# Altium schematic sheet LCD_Direct.SchDoc
size A4
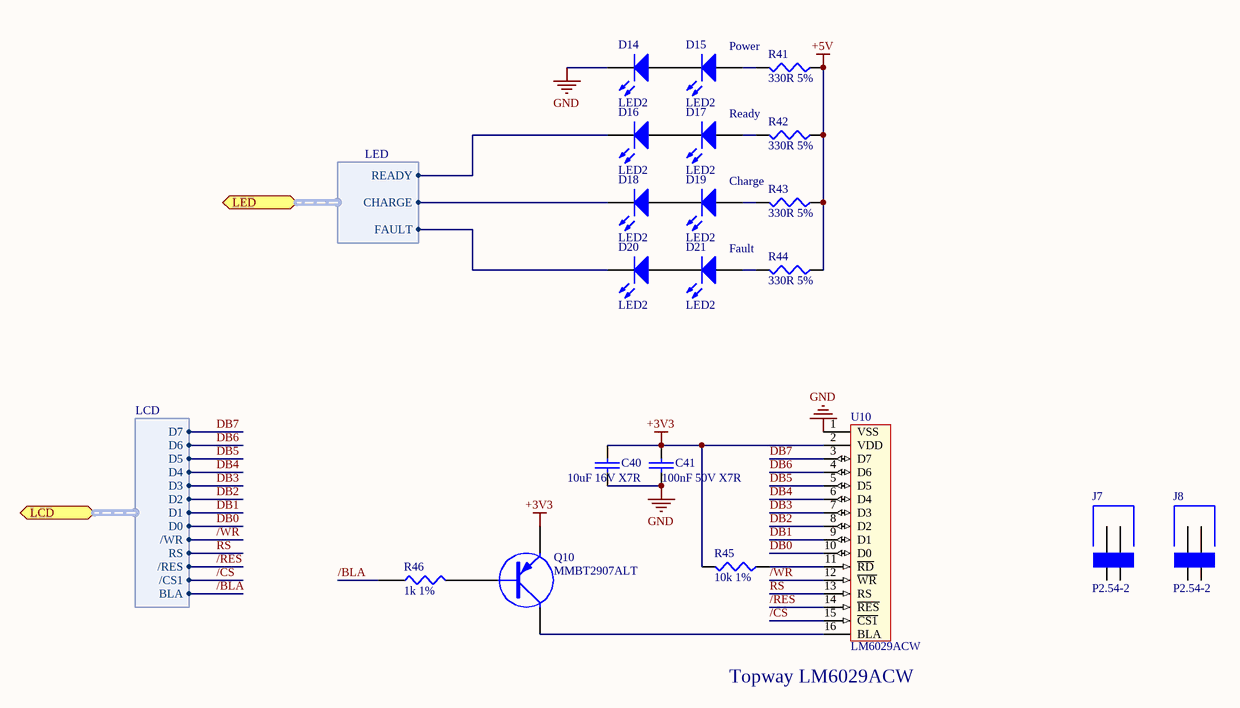
[diagram p0: LCD_Direct.SchDoc]

## Parts
C40  10uF 16V X7R  [CAPC3216N]
C41  100nF 50V X7R  [CAPC2012N]
D14  LED2  [3.2X1.6X1.1]
D15  LED2  [3.2X1.6X1.1]
D16  LED2  [3.2X1.6X1.1]
D17  LED2  [3.2X1.6X1.1]
D18  LED2  [3.2X1.6X1.1]
D19  LED2  [3.2X1.6X1.1]
D20  LED2  [3.2X1.6X1.1]
D21  LED2  [3.2X1.6X1.1]
J7  P2.54-2  [JP2-P2.54]
J8  P2.54-2  [JP2-P2.54]
Q10  MMBT2907ALT  [SOT23-3N]
R41  330R 5%  [RESC2012N]
R42  330R 5%  [RESC2012N]
R43  330R 5%  [RESC2012N]
R44  330R 5%  [RESC2012N]
R45  10k 1%  [RESC2012N]
R46  1k 1%  [RESC2012N]
U10  LM6029ACW  [LM6029A]

## Ports
LCD (harness LCD), LED (harness LED)

## Harnesses
LCD: D7, D6, D5, D4, D3, D2, D1, D0, /WR, RS, /RES, /CS1, BLA
LED: READY, CHARGE, FAULT

## Nets
+3V3: C40.1 C41.1 Q10.2(E) R45.2 U10.2(VDD)
+5V: R41.1 R42.1 R43.1 R44.1
GND: C40.2 C41.2 D14.2(K) U10.1(VSS)
/BLA: R46.1 ; port LCD.BLA
/CS: U10.15(~{CS1}) ; port LCD./CS1
/RES: U10.14(~{RES}) ; port LCD./RES
/WR: U10.12(~{WR}) ; port LCD./WR
DB0: U10.10(D0) ; port LCD.D0
DB1: U10.9(D1) ; port LCD.D1
DB2: U10.8(D2) ; port LCD.D2
DB3: U10.7(D3) ; port LCD.D3
DB4: U10.6(D4) ; port LCD.D4
DB5: U10.5(D5) ; port LCD.D5
DB6: U10.4(D6) ; port LCD.D6
DB7: U10.3(D7) ; port LCD.D7
RS: U10.13(RS) ; port LCD.RS
NetD14_1: D14.1(A) D15.2(K)
NetD15_1: D15.1(A) R41.2
NetD16_1: D16.1(A) D17.2(K)
NetD16_2: D16.2(K) ; port LED.READY
NetD17_1: D17.1(A) R42.2
NetD18_1: D18.1(A) D19.2(K)
NetD18_2: D18.2(K) ; port LED.CHARGE
NetD19_1: D19.1(A) R43.2
NetD20_1: D20.1(A) D21.2(K)
NetD20_2: D20.2(K) ; port LED.FAULT
NetD21_1: D21.1(A) R44.2
NetQ10_1: Q10.1(B) R46.2
NetQ10_3: Q10.3(C) U10.16(BLA)
NetR45_1: R45.1 U10.11(~{RD})

Not connected (* = marked no-connect by the designer): J7 1 2; J8 1 2

## Notes on the sheet
- Power
- Ready
- Charge
- Fault
- (near U10) Topway LM6029ACW

## Library data of the parts
C40 = CAP: Price: 0.025
C41 = CAP: Capacitor
D14-D21 = LED2: Typical RED, GREEN, YELLOW, AMBER GaAs LED; Published: 8-Jun-2000; LatestRevisionDate: 17-Jul-2002; LatestRevisionNote: Re-released for DXP Platform.; PackageDocument: Feb-2002; PackageReference: 3.2X1.6X1.1; Publisher: Altium Limited
J7 J8 = JP2-2.54
Q10 = MMBT3906: PNP transitor; Price: 0.25
R41-R45 = Res3: Resistor
  R45: Published: 8-Jun-2000; LatestRevisionDate: 04-Mar-2005; LatestRevisionNote: PCB Footprint replaced.; PackageReference: J1-0603; Publisher: Altium Limited
R46 = RES1: Price: 0.0025
U10 = LM6029A: Topway LCD module 3.3V; Price: 35